# Altium schematic sheet bluetooth.SchDoc: Opo4
size Letter; Author: William W. Huang; Organization: Altium Limited; Address1: L3, 12a Rodborough Rd; Address2: Frenchs Forest; Address3: NSW; Address4: Australia 2086; Revision: 1
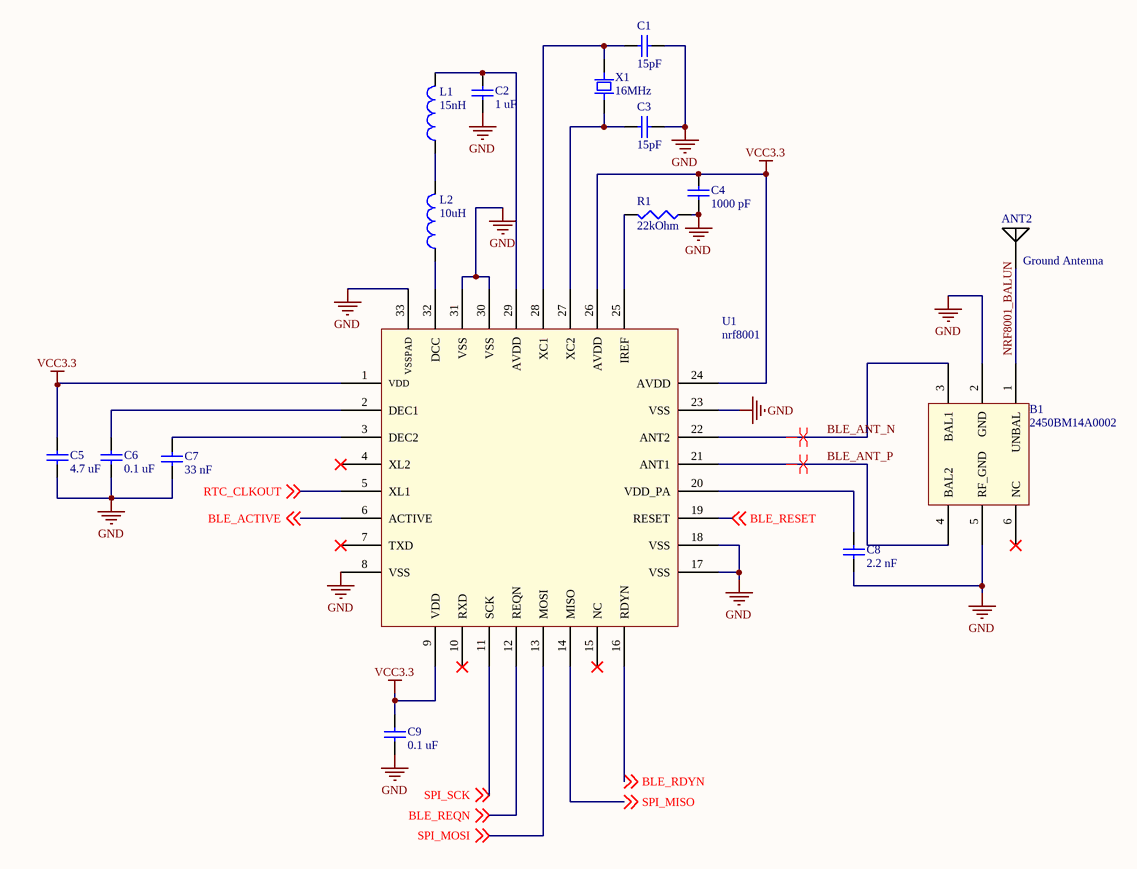
[diagram p0: bluetooth.SchDoc]

## Parts
ANT2  Ground Antenna  [SMD Ground Antenna]
B1  2450BM14A0002  [2450BM14A0002]
C1  value 15pF  [0402]  (hidden comment: 15pF 0402 ceramic cap)
C2  value 1 uF  [0402]  (hidden comment: Ceramic capacitor)
C3  value 15pF  [0402]  (hidden comment: 15pF 0402 ceramic cap)
C4  value 1000 pF  [0402]  (hidden comment: Ceramic capacitor)
C5  value 4.7 uF  [0402]  (hidden comment: 4.7uF)
C6  value 0.1 uF  [0402]  (hidden comment: Ceramic capacitor)
C7  value 33 nF  [0402]  (hidden comment: 33 nF Cap)
C8  value 2.2 nF  [0402]  (hidden comment: 2.2nF Cap)
C9  value 0.1 uF  [0402]  (hidden comment: Ceramic capacitor)
L1  value 15nH  [0402]  (hidden comment: 15nH chip inductor)
L2  value 10uH  [0603]  (hidden comment: 10uH chip inductor)
R1  value 22kOhm  [0402]  (hidden comment: 22k 0402 resistor)
U1  nrf8001  [QFN50P500X500X90_HS-33N]
X1  value 16MHz  [TSX-3225]  (hidden comment: 16MHz Crystal)

## Nets
GND: B1.2(GND) B1.5(RF_GND) C1.2 C2.2 C3.1 C4.2 C5.2 C6.2 C7.2 C8.2 C9.2 R1.2 U1.8(VSS) U1.17(VSS) U1.18(VSS) U1.23(VSS) U1.30(VSS) U1.31(VSS) U1.33(VSSPAD) X1.2 X1.4
VCC3.3: C4.1 C5.1 C9.1 U1.1(VDD) U1.9(VDD) U1.24(AVDD) U1.26(AVDD)
BLE_ACTIVE: U1.6(ACTIVE) ; off-sheet BLE_ACTIVE
BLE_ANT_N: B1.3(BAL1) U1.22(ANT2)
BLE_ANT_P: B1.4(BAL2) U1.21(ANT1)
BLE_RDYN: U1.16(RDYN) ; off-sheet BLE_RDYN
BLE_REQN: U1.12(REQN) ; off-sheet BLE_REQN
BLE_RESET: U1.19(RESET) ; off-sheet BLE_RESET
NRF8001_BALUN: ANT2.1 B1.1(UNBAL)
RTC_CLKOUT: U1.5(XL1) ; off-sheet RTC_CLKOUT
SPI_MISO: U1.14(MISO) ; off-sheet SPI_MISO
SPI_MOSI: U1.13(MOSI) ; off-sheet SPI_MOSI
SPI_SCK: U1.11(SCK) ; off-sheet SPI_SCK
NetC1_1: C1.1 U1.28(XC1) X1.1
NetC2_1: C2.1 L1.1 U1.29(AVDD)
NetC3_2: C3.2 U1.27(XC2) X1.3
NetC6_1: C6.1 U1.2(DEC1)
NetC7_1: C7.1 U1.3(DEC2)
NetC8_1: C8.1 U1.20(VDD_PA)
NetL1_2: L1.2 L2.1
NetL2_2: L2.2 U1.32(DCC)
NetR1_1: R1.1 U1.25(IREF)

Not connected (* = marked no-connect by the designer): B1 6(NC)*; U1 4(XL2)* 7(TXD)* 10(RXD)* 15(NC)*

## Layout directives
differential pair: BLE_ANT_N, BLE_ANT_P

## Notes on the sheet
- Title
- Date:
- Author:
- Revision:
- Sheet
- of
- University of Michigan
- File:

## Library data of the parts
ANT2 = Molex Antenna: Molex 2.4 GHz SMD On-Ground Antenna; Supplier 1: Digikey; Supplier Part Number 1: WM4893CT-ND
B1 = nrf8001_balun: nrf8001 chip balun; Mfr: Johanson; Mfr Part Number: 2450BM14A0002; Supplier 1: Digikey; Supplier Part Number 1: 712-1574-1-ND
C1 C3 = C_15p_0402_ceramic: 15pF, 2%, NP0, 0402; Mfr: Murata; Mfr Part Number: GRM1555C1H150GA01D; Supplier 1: Digikey; Supplier Part Number 1: 490-6201-1-ND
C2 = C_1u_0402_ceramic: Ceramic capacitor, 1 uF, 0402 package; Manufacture: TDK; voltage rated: 6.3 V; tolerance: 10%; package: 0402; Supplier 1: Digi-Key; Supplier Part Number 1: 445-5000-1-ND
C4 = C_1000p_0402_ceramic: Ceramic capacitor, 1000 pF, 0402 package; Manufacture: TDK; voltage rated: 50 V; tolerance: 10%; package: 0402; Supplier 1: Digi-Key; Supplier Part Number 1: 445-6846-1-ND
C5 = C_4.7u_0402_ceramic: 4.7 uF 10% 0402 6.3V X5R ceramic cap; Manufacturer: TDK; Supplier 1: Digikey; Supplier Part Number 1: 445-5947-1-ND
C6 C9 = C_0.1u_0402_ceramic: Ceramic capacitor, 0.1u, 0402 package; Manufacture: TDK; voltage rated: 10 V; tolerance: 10%; Supplier 1: Digi-Key; Supplier Part Number 1: 445-1265-1-ND; package: 0402
C7 = C_0.033uF_0402_ceramic: 33nF 10% 0402 16V X7R ceramic cap; Manufacturer: Samsung; Supplier 1: Digikey; Supplier Part Number 1: 1276-1177-1-ND
C8 = C_2.2n_0402_ceramic: 2.2nF 10% 50V X7R ceramic cap; Manufacturer: TDK; Supplier 1: Digikey; Supplier Part Number 1: 445-1257-1-ND
L1 = L_15nH_0402: 15 nH, 5%, 460mOhm, 2.3Ghz, 0402 chip inductor; Mfr: Taiyo Yuden; Mfr Part Number: HK100515NJ-T; Supplier 1: Digikey; Supplier Part Number 1: 587-1521-1-ND
L2 = L_10u_0603: 10uH, 10%, 32MHz, 468 mOhm, 0603, chip inductor; Mfr: Taiyo Yuden; Mfr Part Number: LBMF1608T100K; Supplier 1: Digikey; Supplier Part Number 1: 587-1714-1-ND
R1 = R_22k_0402: 22k 1% .063W 0402 resistor; Mfr: Samsung; Mfr Part Number: RC1005F223CS; Supplier 1: Digikey; Supplier Part Number 1: 1276-4143-1-ND
U1 = nrf8001: nrf8001 Bluetooth SPI module; Supplier 1: Digikey; Supplier Part Number 1: 1490-1026-ND
X1 = TSX-3225: 3.2x2.5mm 16MHz SMD crystal; Mfr: Epson; Mfr part Number: TSX-3225 16.0000MF09Z-AC3; Supplier 1: Digikey; Supplier Part Number 1: SER3628CT-ND